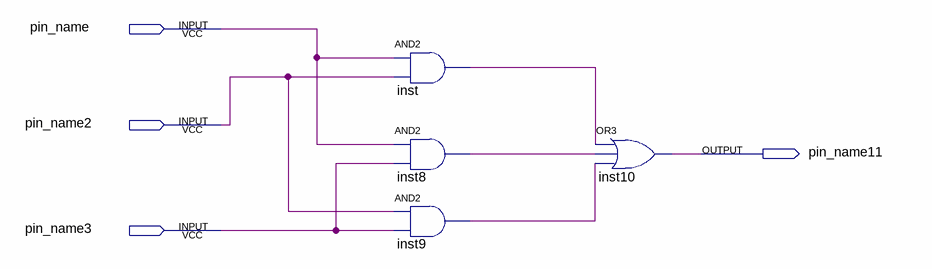
[diagram p0: schematic sheet]
// Quartus schematic q1027.bdf as structural Verilog: 4 symbols, 4 pins
module q1027 (
  input  pin_name,
  input  pin_name2,
  input  pin_name3,
  output pin_name11
);

  wire inst8_out, inst9_out, inst_out;

  and inst (inst_out, pin_name, pin_name2);
  and inst8 (inst8_out, pin_name, pin_name3);
  and inst9 (inst9_out, pin_name2, pin_name3);
  or inst10 (pin_name11, inst_out, inst8_out, inst9_out);
endmodule
